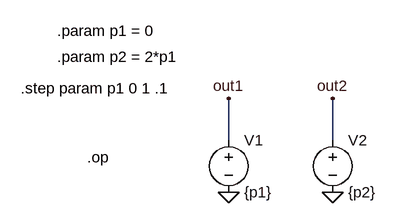
[diagram p0: schematic StepGen.asc]
StepGen.asc, the LTspice schematic file:
Version 4
SHEET 1 880 680
WIRE 64 160 64 224
WIRE 224 160 224 224
FLAG 64 304 0
FLAG 64 160 out1
FLAG 224 304 0
FLAG 224 160 out2
SYMBOL voltage 64 208 R0
WINDOW 123 0 0 Left 0
WINDOW 39 0 0 Left 0
SYMATTR InstName V1
SYMATTR Value {p1}
SYMBOL voltage 224 208 R0
SYMATTR InstName V2
SYMATTR Value {p2}
TEXT -200 96 Left 0 !.param p2 = 2*p1
TEXT -256 144 Left 0 !.step param p1 0 1 .1
TEXT -154 250 Left 0 !.op
TEXT -200 56 Left 0 !.param p1 = 0

The netlist it stands for:
* StepGen.asc
V1 out1 0 {p1}
V2 out2 0 {p2}
.param p2 = 2*p1
.step param p1 0 1 .1
.op
.param p1 = 0
.backanno
.end